# EasyEDA schematic OP1_1.json
TITLE: Sheet_1; REV: 1.0; Date: 2022-10-06; Sheet: 1/1; Company: Your Company
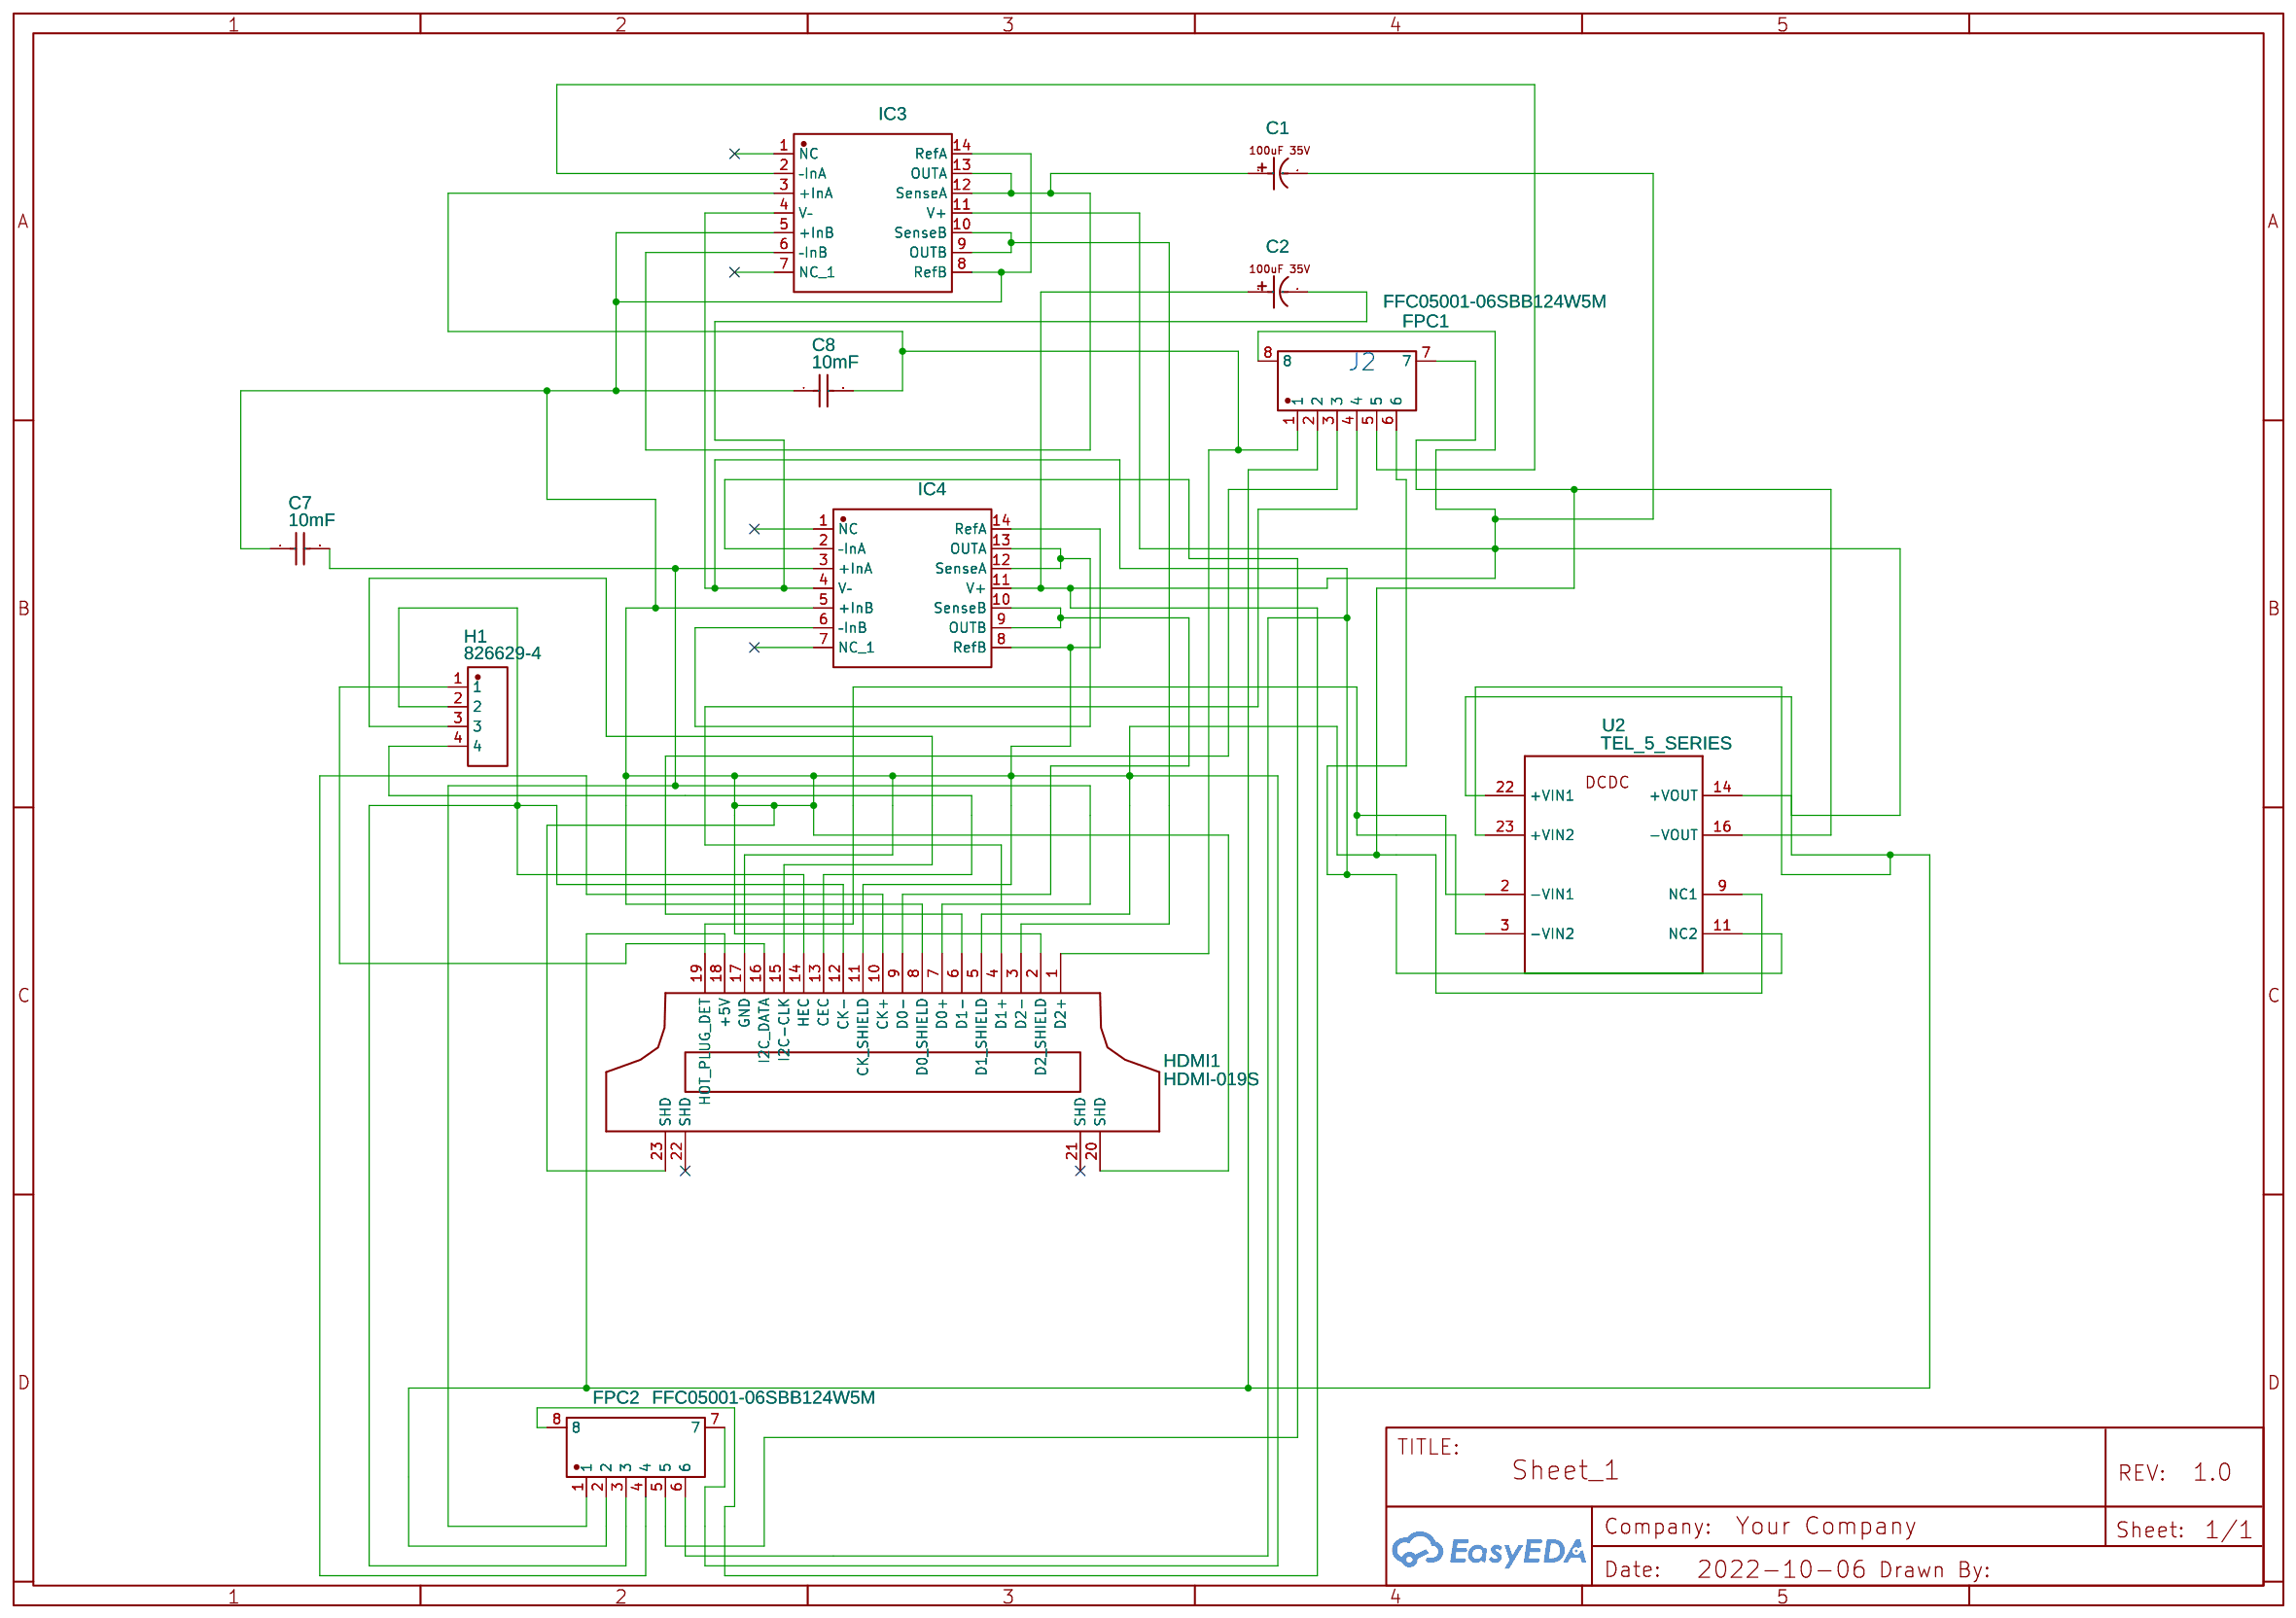
[diagram p0: schematic sheet]

## Parts
C1  CONDENSATORE ELETTROLITICO 35V  [CONDENSATORE ELETTROLITICO 35V]
C2  CONDENSATORE ELETTROLITICO 35V  [CONDENSATORE ELETTROLITICO 35V]
C7  10mF  [C1812]
C8  10mF  [C1812]
FPC1  FFC05001-06SBB124W5M  [FFC-SMD_FFC05001-06SBB124W5M]
FPC2  FFC05001-06SBB124W5M  [FFC-SMD_FFC05001-06SBB124W5M]
H1  826629-4  [HDR-TH_4P-P2.54-V-M-1]
HDMI1  HDMI-019S  [HDMI-SMD_HDMI-019S]
IC3  INA2133UA  [SOIC-14_L8.7-W3.9-P1.27-LS6.0-BL]
IC4  INA2133UA  [SOIC-14_L8.7-W3.9-P1.27-LS6.0-BL]
U2  TEL_5_SERIES  [TEL_5_SERIES]

## Library data of the parts
C1 C2 = CONDENSATORE ELETTROLITICO 35V: Manufacturer: Officine PADANE; Manufacturer Part: 100uF 35V; Supplier: RICCADONNA LUCIANO; Supplier Part: 100uF 35V; Contributor: paolonogara1972
C7 C8 = GRM43DR72J104KW01L: Supplier: LCSC; Manufacturer: MuRata; Supplier Part: C23743; JLCPCB Part Class: Extended Part
FPC1 FPC2 = FFC05001-06SBB124W5M: Supplier: LCSC; Supplier Part: C2834005; Manufacturer: TXGA(特思嘉); Contributor: LCSC; JLCPCB Part Class: Extended Part
H1 = 826629-4: Supplier: LCSC; Supplier Part: C590277; Manufacturer: TE Connectivity(美国泰科); Contributor: LCSC; JLCPCB Part Class: Extended Part
HDMI1 = HDMI-019S: Supplier: LCSC; Manufacturer: SOFNG; Supplier Part: C111617; JLCPCB Part Class: Extended Part
IC3 IC4 = INA2133UA: Supplier: LCSC; Supplier Part: C1347330; Manufacturer: TI(德州仪器); Contributor: LCSC
U2 = TEL_5_SERIES

## Nets
Net-(C1-1): C1.1 IC3.6(–InB) IC3.12(SenseA) IC3.13(OUTA)
Net-(C1-2): C1.2 C2.1 FPC1.8 FPC2.8 IC3.11(V+) IC4.11(V+) U2.14(+VOUT)
Net-(C2-2): C2.2 FPC1.6 FPC2.6 IC3.4(V–) IC4.4(V–) U2.11(NC2)
Net-(C7-1): C7.1 C8.1 FPC1.7 FPC2.7 HDMI1.2(D2_SHIELD) HDMI1.5(D1_SHIELD) HDMI1.8(D0_SHIELD) HDMI1.11(CK_SHIELD) HDMI1.17(GND) HDMI1.20(SHD) HDMI1.23(SHD) IC3.5(+InB) IC3.8(RefB) IC3.14(RefA) IC4.5(+InB) IC4.8(RefB) IC4.14(RefA) U2.9(NC1) U2.16(-VOUT)
Net-(C7-2): C7.2 FPC2.1 HDMI1.7(D0+) IC4.3(+InA)
Net-(C8-2): C8.2 FPC1.1 HDMI1.1(D2+) IC3.3(+InA)
Net-(FPC1-2): FPC1.2 FPC2.2 HDMI1.18(+5V) U2.22(+VIN1) U2.23(+VIN2)
Net-(FPC1-3): FPC1.3 HDMI1.6(D1-)
Net-(FPC1-4): FPC1.4 HDMI1.4(D1+)
Net-(FPC1-5): FPC1.5 IC3.2(–InA)
Net-(FPC2-3): FPC2.3 H1.2 HDMI1.12(CK-) HDMI1.14(HEC)
Net-(FPC2-4): FPC2.4 HDMI1.10(CK+)
Net-(FPC2-5): FPC2.5 IC4.2(–InA)
Net-(H1-1): H1.1 HDMI1.16(I2C_DATA)
Net-(H1-3): H1.3 HDMI1.15(I2C-CLK)
Net-(H1-4): H1.4 HDMI1.13(CEC)
Net-(HDMI1-3): HDMI1.3(D2-) IC3.9(OUTB) IC3.10(SenseB)
Net-(HDMI1-9): HDMI1.9(D0-) IC4.9(OUTB) IC4.10(SenseB)
Net-(HDMI1-19): HDMI1.19(HOT_PLUG_DET) U2.2(-VIN1) U2.3(-VIN2)
Net-(IC4-6): IC4.6(–InB) IC4.12(SenseA) IC4.13(OUTA)

Not connected (* = marked no-connect by the designer): HDMI1 21(SHD)* 22(SHD)*; IC3 1(NC) 7(NC_1); IC4 1(NC) 7(NC_1)

## Notes on the sheet
- J2
